# Altium schematic sheet APC1_Sensors.SchDoc
size A4; Organization: Altium Limited; Address1: L3, 12a Rodborough Rd; Address2: Frenchs Forest; Address3: NSW; Address4: Australia 2086; SheetNumber: 1; SheetTotal: 11
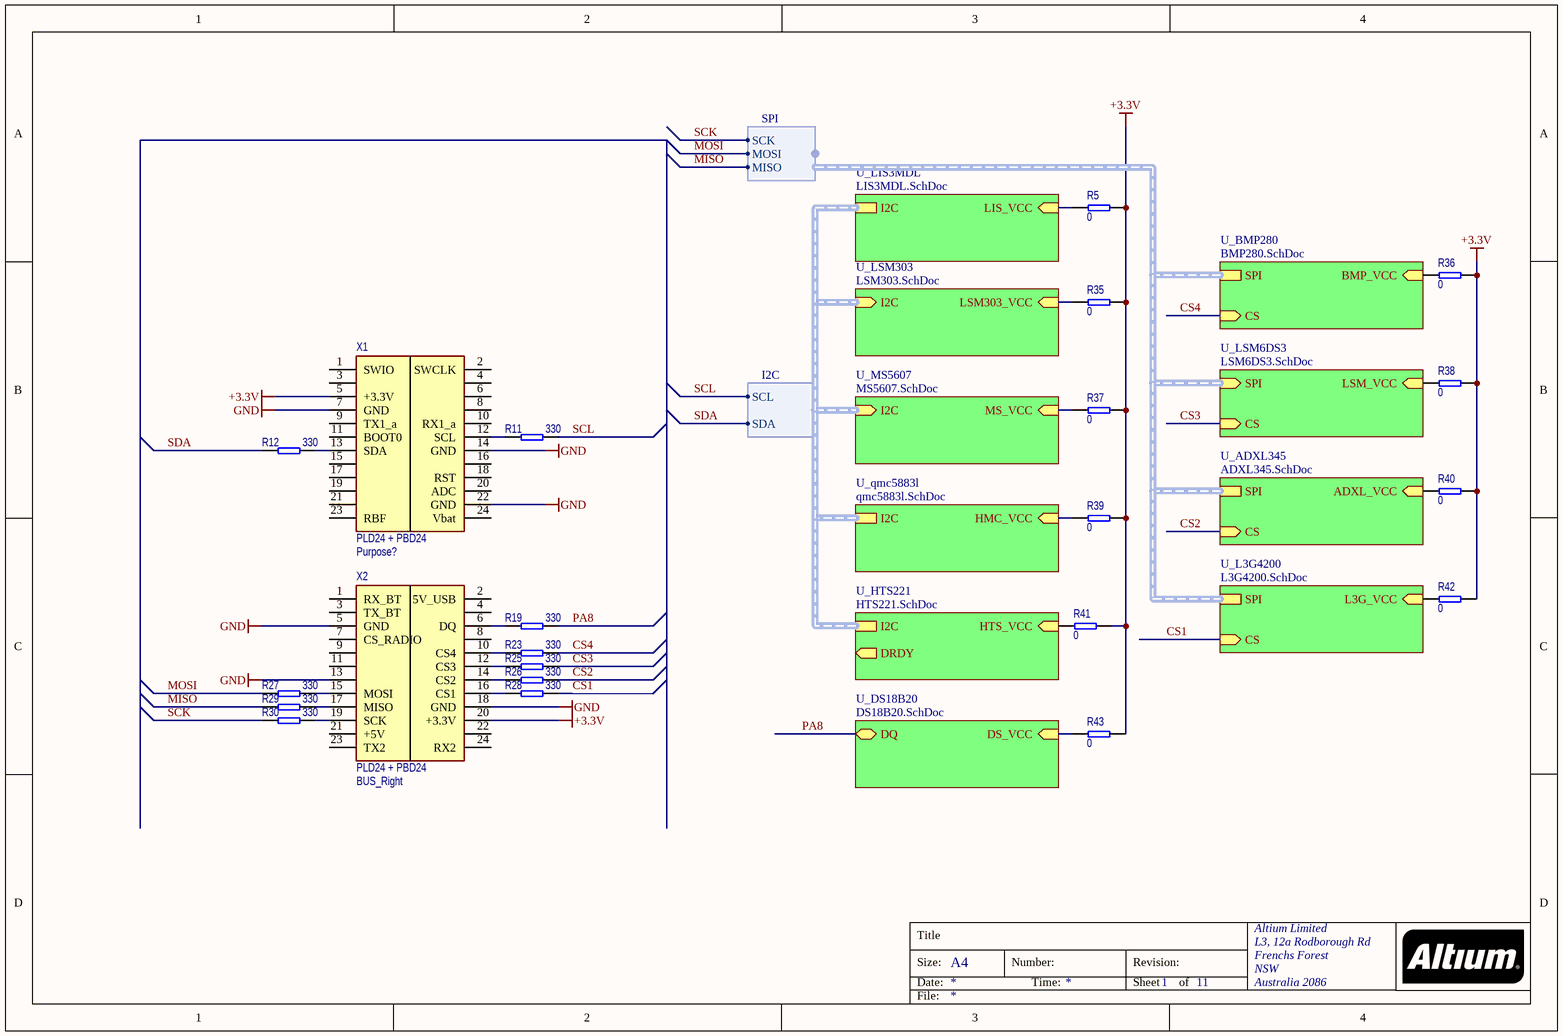
[diagram p0: APC1_Sensors.SchDoc]

## Parts
R5  value 0  [RES 0603]
R11  value 330  [RES 0402]
R12  value 330  [RES 0402]
R19  value 330  [RES 0402]
R23  value 330  [RES 0402]
R25  value 330  [RES 0402]
R26  value 330  [RES 0402]
R27  value 330  [RES 0402]
R28  value 330  [RES 0402]
R29  value 330  [RES 0402]
R30  value 330  [RES 0402]
R35  value 0  [RES 0603]
R36  value 0  [RES 0603]
R37  value 0  [RES 0603]
R38  value 0  [RES 0603]
R39  value 0  [RES 0603]
R40  value 0  [RES 0603]
R41  value 0  [RES 0603]
R42  value 0  [RES 0603]
R43  value 0  [RES 0603]
X1  PLD24 + PBD24  Purpose: Purpose?  [PICOSAT_CNN]
X2  PLD24 + PBD24  Purpose: BUS_Right  [PICOSAT_CNN]

## Sub-sheets
U_ADXL345 = ADXL345.SchDoc: CS (in), ADXL_VCC (in), SPI (harness SPI)
U_BMP280 = BMP280.SchDoc: CS (in), BMP_VCC (in), SPI (harness SPI)
U_DS18B20 = DS18B20.SchDoc: DQ (bidir), DS_VCC (in)
U_HTS221 = HTS221.SchDoc: HTS_VCC (in), DRDY (out), I2C (harness I2C)
U_L3G4200 = L3G4200.SchDoc: CS (in), L3G_VCC (in), SPI (harness SPI)
U_LIS3MDL = LIS3MDL.SchDoc: LIS_VCC (in), I2C (harness I2C)
U_LSM6DS3 = LSM6DS3.SchDoc: CS (in), LSM_VCC (in), SPI (in, harness SPI)
U_LSM303 = LSM303.SchDoc: LSM303_VCC (in), I2C (in, harness I2C)
U_MS5607 = MS5607.SchDoc: I2C (in, harness I2C), MS_VCC (in)
U_qmc5883l = qmc5883l.SchDoc: HMC_VCC (in), I2C (harness I2C)

## Harnesses
I2C: SDA, SCL
SPI: SCK, MOSI, MISO

## Nets
+3.3V: R5.2 R35.2 R36.2 R37.2 R38.2 R39.2 R40.2 R41.2 R42.2 R43.2 X1.5(+3.3V) X2.20(+3.3V)
GND: X1.7(GND) X1.14(GND) X1.22(GND) X2.5(GND) X2.13 X2.18(GND)
CS1: R28.2 ; sheet U_L3G4200/CS
CS2: R26.2 ; sheet U_ADXL345/CS
CS3: R25.2 ; sheet U_LSM6DS3/CS
CS4: R23.2 ; sheet U_BMP280/CS
MISO: R29.1 ; harness SPI.MISO
MOSI: R27.1 ; harness SPI.MOSI
PA8: R19.2 ; sheet U_DS18B20/DQ
SCK: R30.1 ; harness SPI.SCK
SCL: R11.2 ; sheet U_LSM303/I2C.SCL
SDA: R12.1 ; sheet U_LSM303/I2C.SDA
NetR5_1: R5.1 ; sheet U_LIS3MDL/LIS_VCC
NetR11_1: R11.1 X1.12(SCL)
NetR12_2: R12.2 X1.13(SDA)
NetR19_1: R19.1 X2.6(DQ)
NetR23_1: R23.1 X2.10(CS4)
NetR25_1: R25.1 X2.12(CS3)
NetR26_1: R26.1 X2.14(CS2)
NetR27_2: R27.2 X2.15(MOSI)
NetR28_1: R28.1 X2.16(CS1)
NetR29_2: R29.2 X2.17(MISO)
NetR30_2: R30.2 X2.19(SCK)
NetR35_1: R35.1 ; sheet U_LSM303/LSM303_VCC
NetR36_1: R36.1 ; sheet U_BMP280/BMP_VCC
NetR37_1: R37.1 ; sheet U_MS5607/MS_VCC
NetR38_1: R38.1 ; sheet U_LSM6DS3/LSM_VCC
NetR39_1: R39.1 ; sheet U_qmc5883l/HMC_VCC
NetR40_1: R40.1 ; sheet U_ADXL345/ADXL_VCC
NetR41_1: R41.1 ; sheet U_HTS221/HTS_VCC
NetR42_1: R42.1 ; sheet U_L3G4200/L3G_VCC
NetR43_1: R43.1 ; sheet U_DS18B20/DS_VCC

Not connected (* = marked no-connect by the designer): X1 1(SWIO) 2(SWCLK) 3 4 6 8 9(TX1_a) 10(RX1_a) 11(BOOT0) 15 16 17 18(RST) 19 20(ADC) 21 23(RBF) 24(Vbat); X2 1(RX_BT) 2(5V_USB) 3(TX_BT) 4 7(CS_RADIO) 8 9 11 21(+5V) 22 23(TX2) 24(RX2)

## Buses and harness runs
harness sheet U_ADXL345/SPI = sheet U_BMP280/SPI = sheet U_L3G4200/SPI = sheet U_LSM6DS3/SPI
harness sheet U_HTS221/I2C = sheet U_LIS3MDL/I2C = sheet U_LSM303/I2C = sheet U_MS5607/I2C = sheet U_qmc5883l/I2C

## Notes on the sheet
- Title
- Size:
- Date:
- A4
- Number:
- Time:
- Revision:
- Sheet
- of
- File:

## Library data of the parts
R5 R11 R12 R19 R23 R25-R30 R35-R43 = !Resistor: Resistor; IsSMT: NoSMT
X1 X2 = Header 2x12: 10x2 header; IsSMT: NoSMT